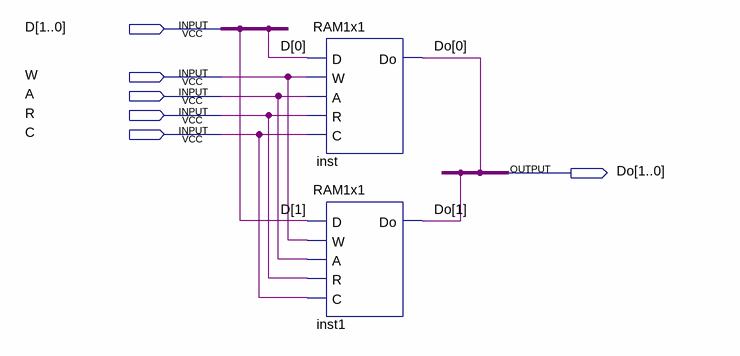
[diagram p0: schematic sheet]
// Quartus schematic RAM1x2.bdf as structural Verilog: 2 symbols, 6 pins
module RAM1x2 (
  input  [1:0] D,
  input  W,
  input  A,
  input  R,
  input  C,
  output [1:0] Do
);

  RAM1x1 inst (.D(D[0]), .W(W), .A(A), .R(R), .C(C), .Do(Do[0]));
  RAM1x1 inst1 (.D(D[1]), .W(W), .A(A), .R(R), .C(C), .Do(Do[1]));
endmodule
